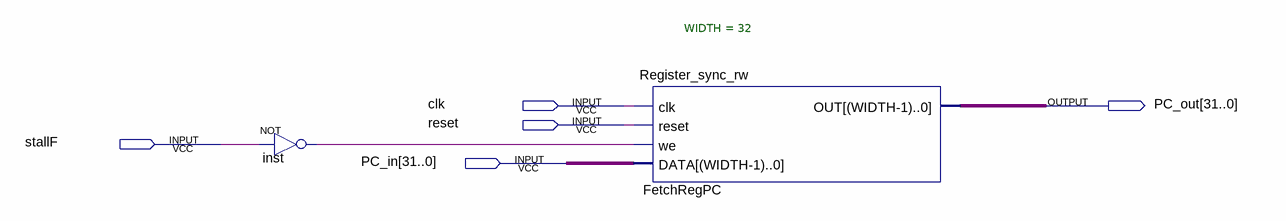
[diagram p0: schematic sheet]
// Quartus schematic fetch_register.bdf as structural Verilog: 2 symbols, 5 pins
module fetch_register (
  input  clk,
  input  reset,
  input  stallF,
  input  [31:0] PC_in,
  output [31:0] PC_out
);

  wire inst_out;

  not inst (inst_out, stallF);
  Register_sync_rw #(.WIDTH(32)) FetchRegPC (.clk(clk), .reset(reset), .we(inst_out), .DATA(PC_in), .OUT(PC_out));
endmodule
